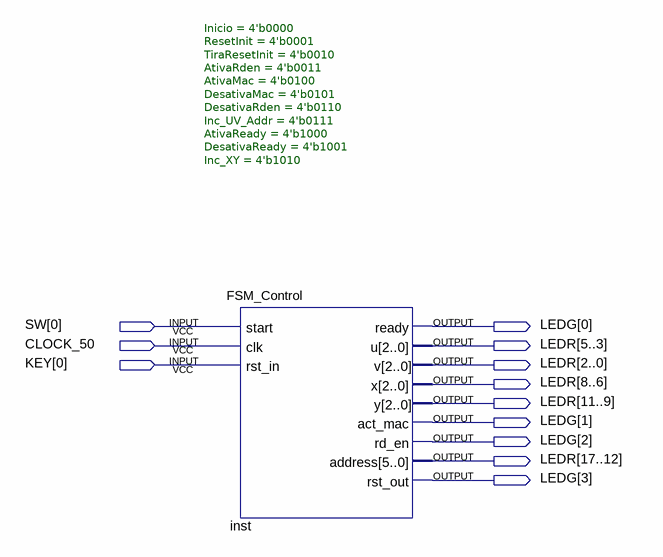
[diagram p0: schematic sheet]
// Quartus schematic MPEG_Diagrama.bdf as structural Verilog: 1 symbols, 12 pins
module MPEG_Diagrama (
  input  [0:0] SW,
  input  CLOCK_50,
  input  [0:0] KEY,
  output [3:0] LEDG,
  output [17:0] LEDR
);

  FSM_Control #(.Inicio(4'b0000), .ResetInit(4'b0001), .TiraResetInit(4'b0010), .AtivaRden(4'b0011), .AtivaMac(4'b0100), .DesativaMac(4'b0101), .DesativaRden(4'b0110), .Inc_UV_Addr(4'b0111), .AtivaReady(4'b1000), .DesativaReady(4'b1001), .Inc_XY(4'b1010)) inst (
    .start(SW[0]), .clk(CLOCK_50), .rst_in(KEY[0]), .ready(LEDG[0]), .u(LEDR[5:3]), .v(LEDR[2:0]),
    .x(LEDR[8:6]), .y(LEDR[11:9]), .act_mac(LEDG[1]), .rd_en(LEDG[2]), .address(LEDR[17:12]),
    .rst_out(LEDG[3]));
endmodule
